# Altium schematic sheet 智能灯_灯泡.SchDoc
size A4
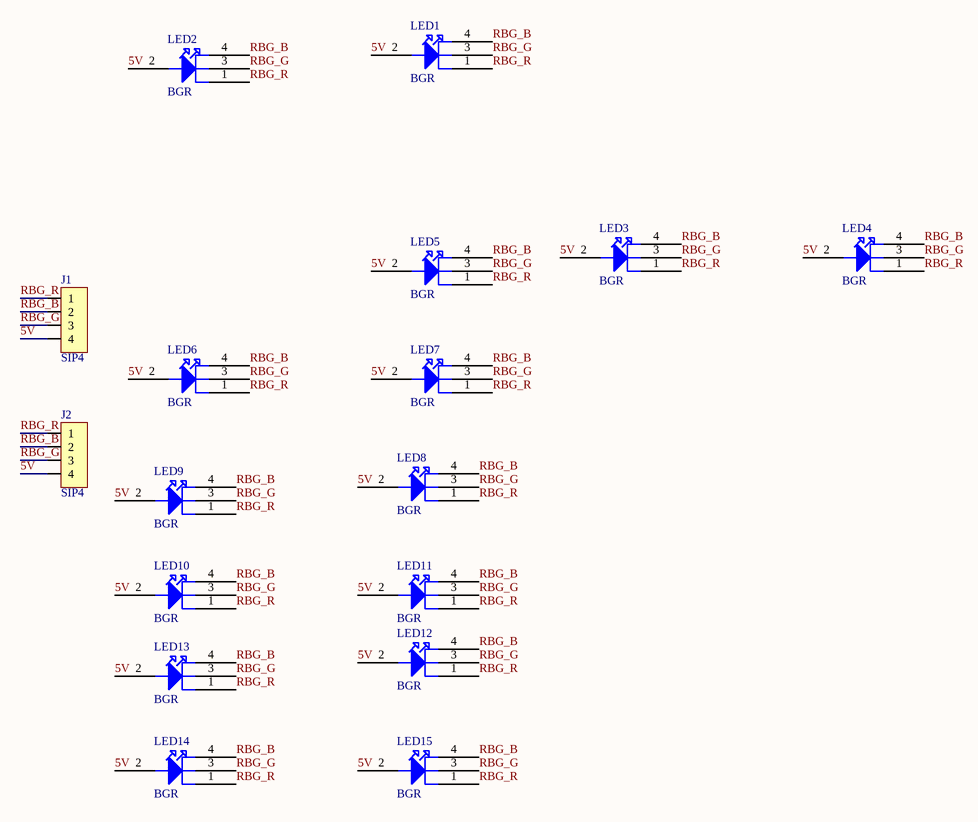
[diagram p0: 智能灯_灯泡.SchDoc]

## Parts
J1  SIP4  [P4_2.54-1]
J2  SIP4  [P4_2.54-1]
LED1  BGR  [10mmRBG]
LED2  BGR  [10mmRBG]
LED3  BGR  [10mmRBG]
LED4  BGR  [10mmRBG]
LED5  BGR  [10mmRBG]
LED6  BGR  [10mmRBG]
LED7  BGR  [10mmRBG]
LED8  BGR  [10mmRBG]
LED9  BGR  [10mmRBG]
LED10  BGR  [10mmRBG]
LED11  BGR  [10mmRBG]
LED12  BGR  [10mmRBG]
LED13  BGR  [10mmRBG]
LED14  BGR  [10mmRBG]
LED15  BGR  [10mmRBG]

## Nets
5V: J1.4 J2.4 LED1.2 LED2.2 LED3.2 LED4.2 LED5.2 LED6.2 LED7.2 LED8.2 LED9.2 LED10.2 LED11.2 LED12.2 LED13.2 LED14.2 LED15.2
RBG_B: J1.2 J2.2 LED1.4 LED2.4 LED3.4 LED4.4 LED5.4 LED6.4 LED7.4 LED8.4 LED9.4 LED10.4 LED11.4 LED12.4 LED13.4 LED14.4 LED15.4
RBG_G: J1.3 J2.3 LED1.3 LED2.3 LED3.3 LED4.3 LED5.3 LED6.3 LED7.3 LED8.3 LED9.3 LED10.3 LED11.3 LED12.3 LED13.3 LED14.3 LED15.3
RBG_R: J1.1 J2.1 LED1.1 LED2.1 LED3.1 LED4.1 LED5.1 LED6.1 LED7.1 LED8.1 LED9.1 LED10.1 LED11.1 LED12.1 LED13.1 LED14.1 LED15.1

## Library data of the parts
LED1-LED15 = LED_4P: DUAL_LED共阳三色